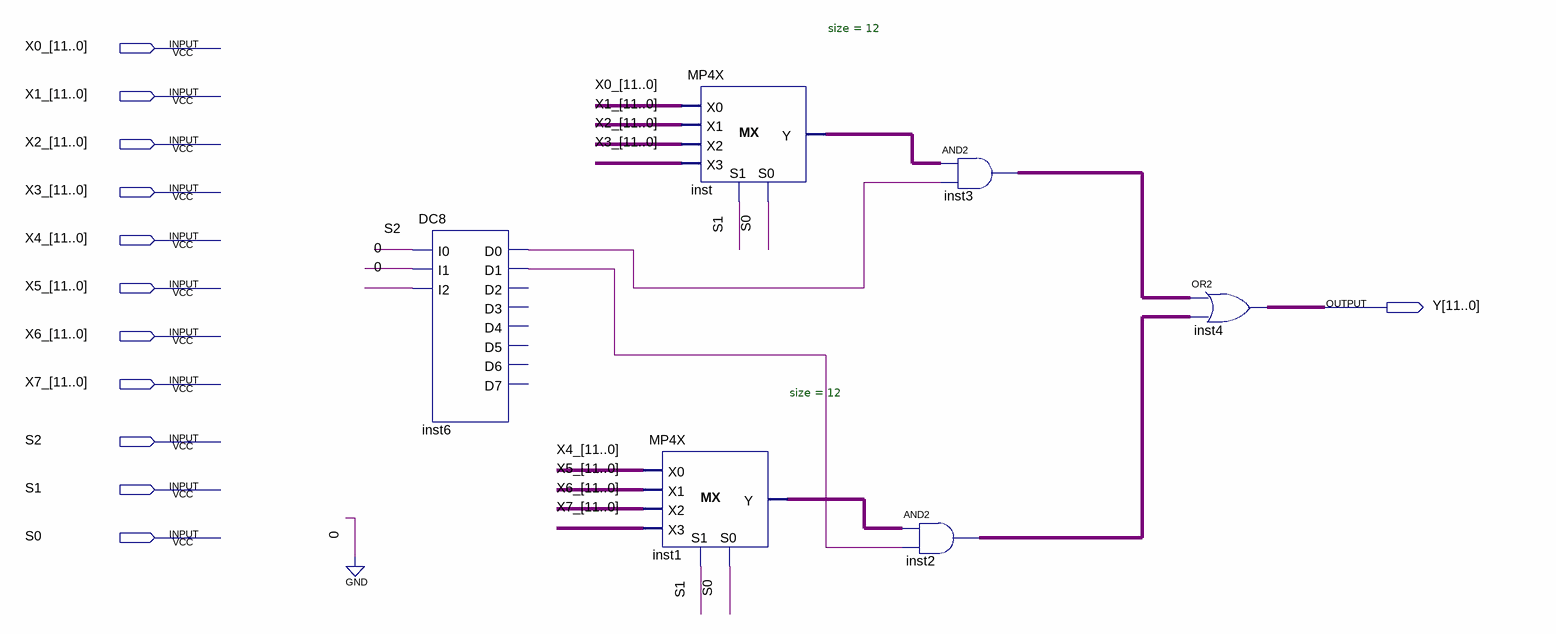
[diagram p0: schematic sheet]
// Quartus schematic MX12_3.bdf as structural Verilog: 6 symbols, 12 pins
module MX12_3 (
  input  [11:0] X0_,
  input  [11:0] X1_,
  input  [11:0] X2_,
  input  [11:0] X3_,
  input  [11:0] X4_,
  input  [11:0] X5_,
  input  [11:0] X6_,
  input  [11:0] X7_,
  input  S2,
  input  S1,
  input  S0,
  output [11:0] Y
);

  wire inst6_d0, inst6_d1;
  wire [11:0] inst1_y, inst2_out, inst3_out, inst_y;

  DC8 inst6 (.I0(S2), .I1(1'b0), .I2(1'b0), .D0(inst6_d0), .D1(inst6_d1));  // open: D2, D3, D4, D5, D6, D7
  MP4X #(.size(12)) inst1 (.S0(S0), .S1(S1), .X0(X4_), .X1(X5_), .X2(X6_), .X3(X7_), .Y(inst1_y));
  MP4X #(.size(12)) inst (.S0(S0), .S1(S1), .X0(X0_), .X1(X1_), .X2(X2_), .X3(X3_), .Y(inst_y));
  assign inst3_out = inst_y & {12{inst6_d0}};  // AND2 inst3, 12 bits wide
  assign inst2_out = inst1_y & {12{inst6_d1}};  // AND2 inst2, 12 bits wide
  assign Y = inst3_out | inst2_out;  // OR2 inst4, 12 bits wide
endmodule
